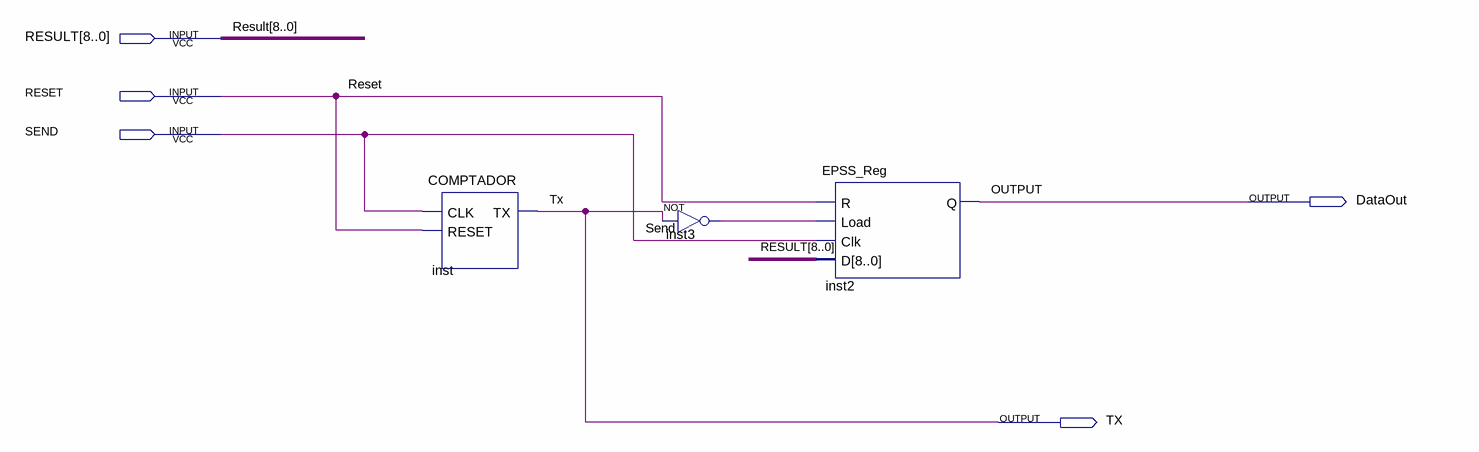
[diagram p0: schematic sheet]
// Quartus schematic BLOC3_SEND.bdf as structural Verilog: 3 symbols, 5 pins
module BLOC3_SEND (
  input  [8:0] RESULT,
  input  RESET,
  input  SEND,
  output DataOut,
  output TX
);

  wire inst3_out;

  COMPTADOR inst (.CLK(SEND), .RESET(RESET), .TX(TX));
  not inst3 (inst3_out, TX);
  EPSS_Reg inst2 (.R(RESET), .Load(inst3_out), .Clk(SEND), .D(RESULT), .Q(DataOut));

  // Other names for the same wires on the sheet: OUTPUT = DataOut
endmodule
